# Altium project spine.PrjPcb
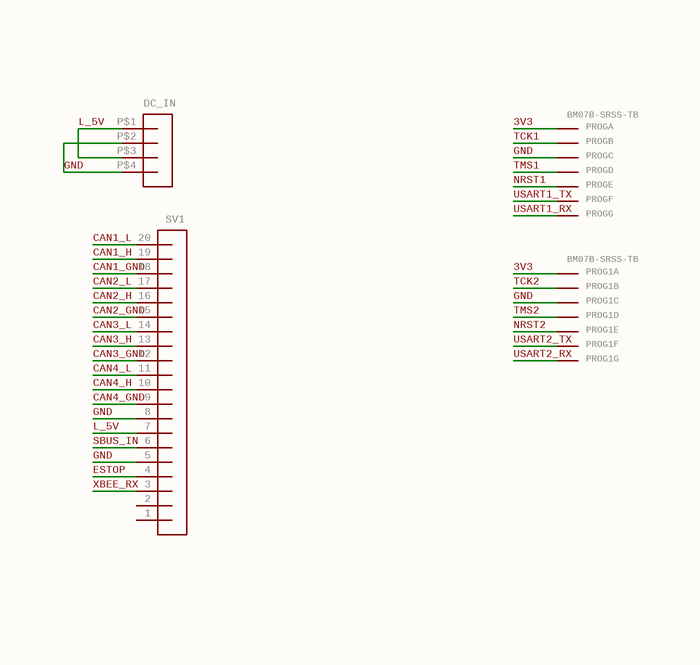
[diagram p0: spine_1.SchDoc]
2 sheets, 10 parts. Net scope: global (net labels, ports and power ports of the same name join across sheets).
Board file: spine_v2_smaller.PcbDoc
Sheets:
  spine_1.SchDoc
  spine_2.SchDoc

## Sheet spine_1.SchDoc
size 120 x 114 mm; Origin: Eagle

### Parts
DC_IN  HEADER_POS4_?43045-0401  [43045-0400]  (value not drawn)
PROG  BM07B-SRSS-TB  [BM07B-SRSS-TB]  (parts A,B,C,D,E,F,G of 7)
PROG1  BM07B-SRSS-TB  [BM07B-SRSS-TB]  (parts A,B,C,D,E,F,G of 7)
SV1  MA20-1L  [MA20-1L]  (value not drawn)

### Nets
3V3: PROG.1(S) PROG1.1(S)
CAN1_GND: SV1.18
CAN1_H: SV1.19
CAN1_L: SV1.20
CAN2_GND: SV1.15
CAN2_H: SV1.16
CAN2_L: SV1.17
CAN3_GND: SV1.12
CAN3_H: SV1.13
CAN3_L: SV1.14
CAN4_GND: SV1.9
CAN4_H: SV1.10
CAN4_L: SV1.11
ESTOP: SV1.4
GND: DC_IN.P$1 DC_IN.P$2 DC_IN.P$3 DC_IN.P$4 PROG.3(S) PROG1.3(S) SV1.5 SV1.7 SV1.8  [also labelled L_5V]
NRST1: PROG.5(S)
NRST2: PROG1.5(S)
SBUS_IN: SV1.6
TCK1: PROG.2(S)
TCK2: PROG1.2(S)
TMS1: PROG.4(S)
TMS2: PROG1.4(S)
USART1_RX: PROG.7(S)
USART1_TX: PROG.6(S)
USART2_RX: PROG1.7(S)
USART2_TX: PROG1.6(S)
XBEE_RX: SV1.3

Not connected (* = marked no-connect by the designer): SV1 1 2

### Library data of the parts
DC_IN = HEADER_POS4_?43045-0401: Molex - Micro-Fit 3.0 Series connector,  3.00mm (0.118") pitch header, 4 positions.; GateName_1: G$1; SymbolName_1: HEADER_POS4; DeviceName: 43045-0401; LibraryName: con-molex-micro-fit-3_0; DeviceSetName: HEADER_POS4_?; MATERIAL: MATERIAL
PROG PROG1 = ?M07B-SRSS-TBB: Disconnectable Crimp style connector, 1.0mm pitch 7 contacts; GateName_1: -1; SymbolName_1: KV; GateName_2: -2; SymbolName_2: K; GateName_3: -3; GateName_4: -4; GateName_5: -5; GateName_6: -6; GateName_7: -7; DeviceName: B; SymbolName_3: K; SymbolName_4: K; SymbolName_5: K; SymbolName_6: K; SymbolName_7: K; LibraryName: con-jst2; DeviceSetName: ?M07B-SRSS-TB
SV1 = MA20-1L: PIN HEADER; GateName_1: 1; SymbolName_1: MA20-1; LibraryName: con-lstb; DeviceSetName: MA20-1L; MF: MF; MPN: MPN; OC_FARNELL: unknown; OC_NEWARK: unknown

## Sheet spine_2.SchDoc
size 76 x 93 mm; Origin: Eagle
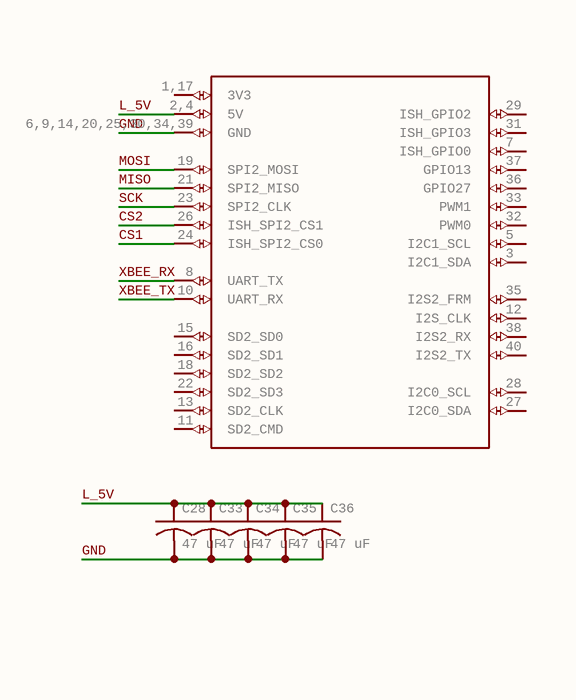
[diagram p1: spine_2.SchDoc]

### Parts
C28  47 uF  [C1206K]
C33  47 uF  [C1206K]
C34  47 uF  [C1206K]
C35  47 uF  [C1206K]
C36  47 uF  [C1206K]
U$2  UP_BOARD  [UP_BOARD]  (value not drawn)

### Nets
CS1: U$2.24(ISH_SPI2_CS0)
CS2: U$2.26(ISH_SPI2_CS1)
GND: C28.1 C28.2 C33.1 C33.2 C34.1 C34.2 C35.1 C35.2 C36.1 C36.2 U$2.2,4(5V) U$2.6,9,14,20,25,30,34,39(GND)  [also labelled L_5V]
MISO: U$2.21(SPI2_MISO)
MOSI: U$2.19(SPI2_MOSI)
SCK: U$2.23(SPI2_CLK)
XBEE_RX: U$2.8(UART_TX)
XBEE_TX: U$2.10(UART_RX)

Not connected (* = marked no-connect by the designer): U$2 1,17(3V3) 3(I2C1_SDA) 5(I2C1_SCL) 7(ISH_GPIO0) 11(SD2_CMD) 12(I2S_CLK) 13(SD2_CLK) 15(SD2_SD0) 16(SD2_SD1) 18(SD2_SD2) 22(SD2_SD3) 27(I2C0_SDA) 28(I2C0_SCL) 29(ISH_GPIO2) 31(ISH_GPIO3) 32(PWM0) 33(PWM1) 35(I2S2_FRM) 36(GPIO27) 37(GPIO13) 38(I2S2_RX) 40(I2S2_TX)

### Library data of the parts
C28 C33-C36 = C-USC1206K: CAPACITOR, American symbol; GateName_1: G$1; SymbolName_1: C-US; DeviceName: C1206K; LibraryName: rcl; DeviceSetName: C-US
U$2 = UP_BOARD: GateName_1: G$1; SymbolName_1: UP_BOARD; LibraryName: BenLibrary; DeviceSetName: UP_BOARD

## Nets that join several sheets
GND: spine_1 (9 pins), spine_2 (12 pins)
XBEE_RX: spine_1 (SV1.3), spine_2 (U$2.8)